# EAGLE schematic plant-monitoring-system (EAGLE 9.3.2)
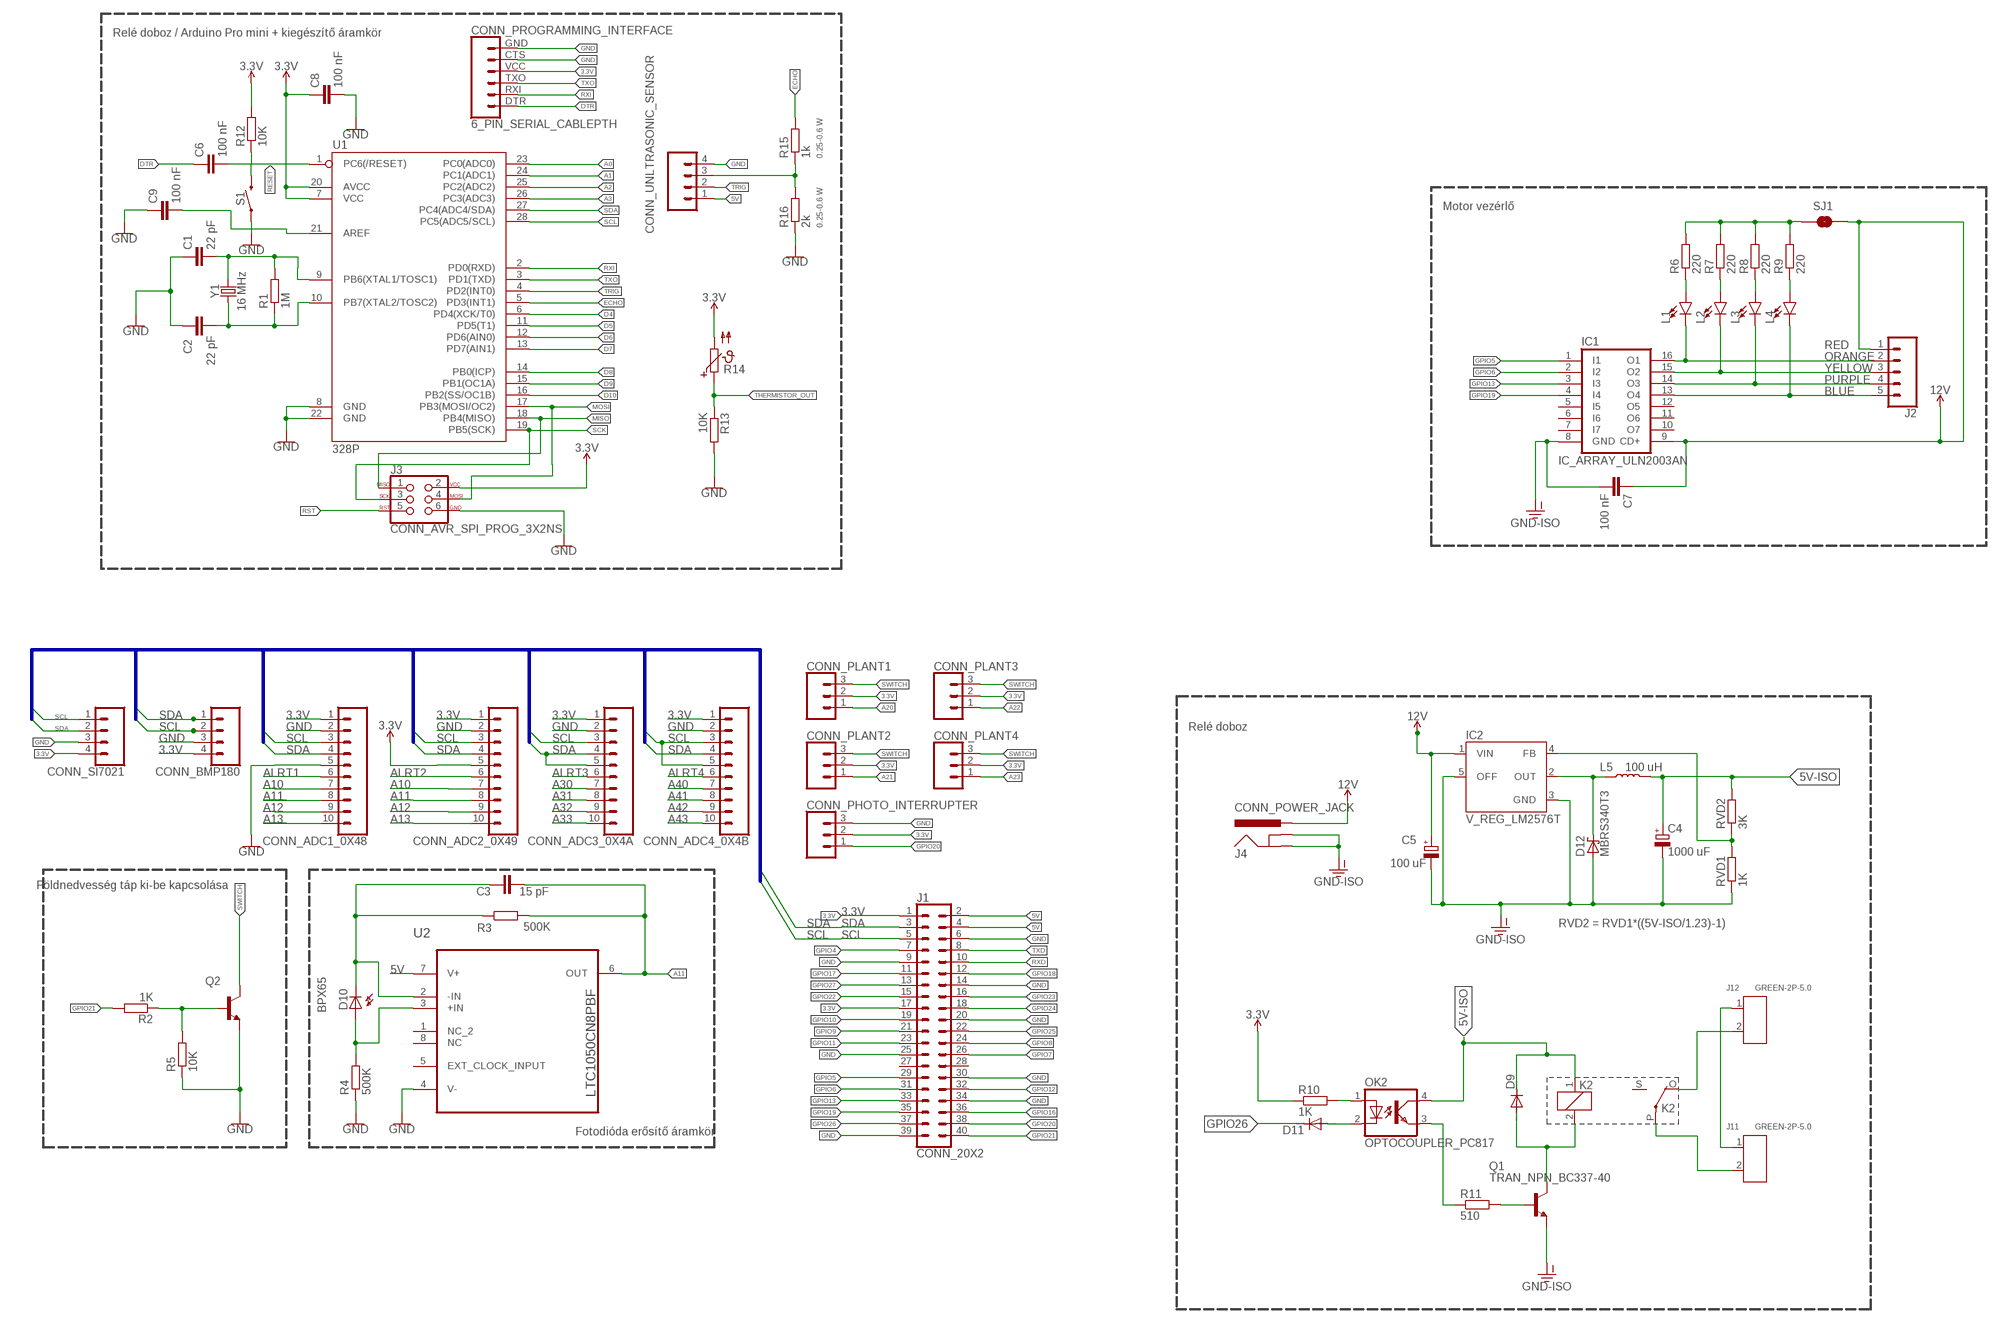
[diagram p0: schematic, sheet 1]

## Parts
C1  22 pF  CAPACITOR_1025-024X044  [C025-024X044]
C2  22 pF  CAPACITOR_1025-024X044  [C025-024X044]
C3  15 pF  CAPACITOR_1025-024X044  [C025-024X044]
C4  1000 uF  CAPACITOR_POLARIZEDE5-10.5  [E5-10,5]
C5  100 uF  CAPACITOR_POLARIZEDE2.5-6  [E2,5-6]
C6  100 nF  CAPACITOR_1025-024X044  [C025-024X044]
C7  100 nF  CAPACITOR_1025-024X044  [C025-024X044]
C8  100 nF  CAPACITOR_1025-024X044  [C025-024X044]
C9  100 nF  CAPACITOR_1025-024X044  [C025-024X044]
CONN_ADC1_0X48  CONN_10"  [1X10]
CONN_ADC2_0X49  CONN_10"  [1X10]
CONN_ADC3_0X4A  CONN_10"  [1X10]
CONN_ADC4_0X4B  CONN_10"  [1X10]
CONN_BMP180  CONN_04  [1X04]
CONN_PHOTO_INTERRUPTER  CONN_03  [1X03]
CONN_PLANT1  CONN_03  [1X03]
CONN_PLANT2  CONN_03  [1X03]
CONN_PLANT3  CONN_03  [1X03]
CONN_PLANT4  CONN_03  [1X03]
CONN_PROGRAMMING_INTERFACE  6_PIN_SERIAL_CABLEPTH  [FTDI_BASIC]
CONN_SI7021  CONN_04  [1X04]
CONN_UNLTRASONIC_SENSOR  CONN_04  [1X04]
D9  DIODED-10  [D-10]
D10  BPX65  [BPX65]
D11  DIODED-7.5  [D-7.5]
D12  MBRS340T3  [SMC]
IC1  IC_ARRAY_ULN2003AN  [DIL16]
IC2  V_REG_LM2576T  [TO220-5]
J1  CONN_20X2  [2X20]
J2  CONN_05  [1X05]
J3  CONN_AVR_SPI_PROG_3X2NS  [2X3-NS]
J4  CONN_POWER_JACK  [POWER_JACK_PTH]
J11  GREEN-2P-5.0  SCREW-TERMINAL-GREEN(2P-5.0)  [H2-5.0-10.5X8.0MM]
J12  GREEN-2P-5.0  SCREW-TERMINAL-GREEN(2P-5.0)  [H2-5.0-10.5X8.0MM]
K2  RELAY_ZF112  [ZF112]
L1  LED3MM  [LED_3MM]
L2  LED3MM  [LED_3MM]
L3  LED3MM  [LED_3MM]
L4  LED3MM  [LED_3MM]
L5  100 uH  INDUCTOR_2-SRN6045-33UH  [SRN6045]
OK2  OPTOCOUPLER_PC817  [DIL04]
Q1  TRAN_NPN_BC337-40  [TO92]
Q2  TRAN_NPN_BC337-40  [TO92]
R1  1M  RESISTOR0207/7  [0207/7]
R2  1K  RESISTOR0207/7  [0207/7]
R3  500K  RESISTOR0207/7  [0207/7]
R4  500K  RESISTOR0207/7  [0207/7]
R5  10K  RESISTOR0207/7  [0207/7]
R6  220  RESISTOR0207/7  [0207/7]
R7  220  RESISTOR0207/7  [0207/7]
R8  220  RESISTOR0207/7  [0207/7]
R9  220  RESISTOR0207/7  [0207/7]
R10  1K  RESISTOR0207/7  [0207/7]
R11  510  RESISTOR0207/7  [0207/7]
R12  10K  RESISTOR0207/7  [0207/7]
R13  10K  RESISTOR0207/7  [0207/7]
R14  PTC679  [P679]
R15  1k  RESISTOR0207/7  [0207/7]
R16  2k  RESISTOR0207/7  [0207/7]
RVD1  1K  RESISTOR0207/7  [0207/7]
RVD2  3K  RESISTOR0207/7  [0207/7]
S1  INPUT_MOMENTARY_SWITCH_SPST-PTH-6.0MM  [TACTILE_SWITCH_PTH_6.0MM]
SJ1  INPUT_SOLDERJUMPERROUND  [SJ_ROUND]
U1  328P  MCU_ATMEGA328P_PDIP  [DIP28]
U2  LTC1050CN8PBF  [DIP254P762X508-8]
Y1  16 MHz  CRYSTALPTH-HC49US  [HC49US]

## Nets
3.3V: C8.1 CONN_ADC1_0X48.1 CONN_ADC2_0X49.1 CONN_ADC2_0X49.5 CONN_ADC3_0X4A.1 CONN_ADC4_0X4B.1 CONN_BMP180.4 CONN_PHOTO_INTERRUPTER.2 CONN_PLANT1.2 CONN_PLANT2.2 CONN_PLANT3.2 CONN_PLANT4.2 CONN_PROGRAMMING_INTERFACE.VCC CONN_SI7021.4 J1.1 J1.17 J3.2 R10.1 R12.2 R14.2 U1.7(VCC) U1.20(AVCC)
5V: CONN_UNLTRASONIC_SENSOR.1 J1.2 J1.4 U2.7(V+)
5V-ISO: C4.+ D9.C K2.1 L5.2 OK2.4(COL) RVD2.2
12V: C5.+ IC2.1(VIN) J4.PWR
A0: U1.23(PC0(ADC0))
A1: U1.24(PC1(ADC1))
A2: U1.25(PC2(ADC2))
A3: U1.26(PC3(ADC3))
A10: CONN_ADC1_0X48.7 CONN_ADC2_0X49.7
A11: C3.2 CONN_ADC1_0X48.8 CONN_ADC2_0X49.8 R3.2 U2.6(OUT)
A12: CONN_ADC1_0X48.9 CONN_ADC2_0X49.9
A13: CONN_ADC1_0X48.10 CONN_ADC2_0X49.10
A20: CONN_PLANT1.1
A21: CONN_PLANT2.1
A22: CONN_PLANT3.1
A23: CONN_PLANT4.1
A30: CONN_ADC3_0X4A.7
A31: CONN_ADC3_0X4A.8
A32: CONN_ADC3_0X4A.9
A33: CONN_ADC3_0X4A.10
A40: CONN_ADC4_0X4B.7
A41: CONN_ADC4_0X4B.8
A42: CONN_ADC4_0X4B.9
A43: CONN_ADC4_0X4B.10
ALRT1: CONN_ADC1_0X48.6
ALRT2: CONN_ADC2_0X49.6
ALRT3: CONN_ADC3_0X4A.6
ALRT4: CONN_ADC4_0X4B.6
BLUE: IC1.13(O4) J2.5 L4.K(C)
D4: U1.6(PD4(XCK/T0))
D5: U1.11(PD5(T1))
D6: U1.12(PD6(AIN0))
D7: U1.13(PD7(AIN1))
D8: U1.14(PB0(ICP))
D9: U1.15(PB1(OC1A))
D10: U1.16(PB2(SS/OC1B))
DTR: C6.1 CONN_PROGRAMMING_INTERFACE.DTR
ECHO: R15.2 U1.5(PD3(INT1))
GND: C1.1 C2.1 C8.2 C9.1 CONN_ADC1_0X48.2 CONN_ADC1_0X48.5 CONN_ADC2_0X49.2 CONN_ADC3_0X4A.2 CONN_ADC4_0X4B.2 CONN_BMP180.3 CONN_PHOTO_INTERRUPTER.3 CONN_PROGRAMMING_INTERFACE.CTS CONN_PROGRAMMING_INTERFACE.GND CONN_SI7021.3 CONN_UNLTRASONIC_SENSOR.4 J1.6 J1.9 J1.14 J1.20 J1.25 J1.30 J1.34 J1.39 J3.6 Q2.1(E) R4.1 R5.1 R13.2 R16.1 S1.1 U1.8(GND) U1.22(GND) U2.4(V-)
GND-ISO: C4.- C5.- C7.2 D12.A IC1.8(GND) IC2.3(GND) IC2.5(OFF) J4.GND J4.GNDBREAK Q1.1(E) RVD1.1
GPIO4: J1.7
GPIO5: IC1.1(I1) J1.29
GPIO6: IC1.2(I2) J1.31
GPIO7: J1.26
GPIO8: J1.24
GPIO9: J1.21
GPIO10: J1.19
GPIO11: J1.23
GPIO12: J1.32
GPIO13: IC1.3(I3) J1.33
GPIO16: J1.36
GPIO17: J1.11
GPIO18: J1.12
GPIO19: IC1.4(I4) J1.35
GPIO20: CONN_PHOTO_INTERRUPTER.1 J1.38
GPIO21: J1.40 R2.2
GPIO22: J1.15
GPIO23: J1.16
GPIO24: J1.18
GPIO25: J1.22
GPIO26: D11.C J1.37
GPIO27: J1.13
MISO: J3.1 U1.18(PB4(MISO))
MOSI: J3.4 U1.17(PB3(MOSI/OC2))
N$5: CONN_UNLTRASONIC_SENSOR.3 R15.1 R16.2
N$6: C3.1 D10.K(C) R3.1 U2.2(-IN)
N$7: D10.A R4.2 U2.3(+IN)
N$12: Q2.2(B) R2.1 R5.2
N$23: L1.A R6.1
N$24: L2.A R7.1
N$25: L3.A R8.1
N$26: L4.A R9.1
N$27: R6.2 R7.2 R8.2 R9.2 SJ1.1
N$28: OK2.3(EMIT) R11.1
N$29: D9.A K2.2 Q1.3(C)
N$30: OK2.1(A) R10.2
N$31: D11.A OK2.2(C)
N$33: J12.2 K2.O(2:O)
N$34: Q1.2(B) R11.2
N$35: J11.1 J12.1
N$36: J11.2 K2.P(2:P)
N$37: C1.2 R1.2 U1.9(PB6(XTAL1/TOSC1)) Y1.2
N$38: D12.C IC2.2(OUT) L5.1
N$39: IC2.4(FB) RVD1.2 RVD2.1
N$40: C2.2 R1.1 U1.10(PB7(XTAL2/TOSC2)) Y1.1
N$45: C9.2 U1.21(AREF)
ORANGE: IC1.16(O1) J2.2 L1.K(C)
PURPLE: IC1.14(O3) J2.4 L3.K(C)
RED: C7.1 IC1.9(CD+) J2.1 SJ1.2 ; supply symbol labelled 12V
RESET: C6.2 R12.1 S1.3 U1.1(PC6(/RESET))
RST: J3.5
RXD: J1.10
RXI: CONN_PROGRAMMING_INTERFACE.RXI U1.2(PD0(RXD))
SCK: J3.3 U1.19(PB5(SCK))
SCL: CONN_ADC1_0X48.3 CONN_ADC2_0X49.3 CONN_ADC3_0X4A.3 CONN_ADC4_0X4B.3 CONN_ADC4_0X4B.5 CONN_BMP180.1 CONN_SI7021.1 J1.5 U1.28(PC5(ADC5/SCL))
SDA: CONN_ADC1_0X48.4 CONN_ADC2_0X49.4 CONN_ADC3_0X4A.4 CONN_ADC3_0X4A.5 CONN_ADC4_0X4B.4 CONN_BMP180.2 CONN_SI7021.2 J1.3 U1.27(PC4(ADC4/SDA))
SWITCH: CONN_PLANT1.3 CONN_PLANT2.3 CONN_PLANT3.3 CONN_PLANT4.3 Q2.3(C)
THERMISTOR_OUT: R13.1 R14.1
TRIG: CONN_UNLTRASONIC_SENSOR.2 U1.4(PD2(INT0))
TXD: J1.8
TXO: CONN_PROGRAMMING_INTERFACE.TXO U1.3(PD1(TXD))
YELLOW: IC1.15(O2) J2.3 L2.K(C)
Unconnected: IC1.5(I5) IC1.6(I6) IC1.7(I7) IC1.10(O7) IC1.11(O6) IC1.12(O5) J1.27 J1.28 K2.S(2:S) U2.1(NC_2) U2.5(EXT_CLOCK_INPUT) U2.8(NC)

## Buses
I2C:SCL,SDA
SCL,SDA

## Notes on the sheet
- Relé doboz / Arduino Pro mini + kiegészítő áramkör
- Motor vezérlő
- Relé doboz
- Földnedvesség táp ki-be kapcsolása
- RVD2 = RVD1*((5V-ISO/1.23)-1)
- Fotodióda erősítő áramkör

## Library data of the parts
C1-C3 C6-C9 = 001-private-inventory:CAPACITOR_1: CAPACITOR, European symbol; SPICEPREFIX: C
C4 C5 = 001-private-inventory:CAPACITOR_POLARIZED: POLARIZED CAPACITOR, European symbol; SPICEPREFIX: C
CONN_ADC1_0X48 CONN_ADC2_0X49 CONN_ADC3_0X4A CONN_ADC4_0X4B = 001-private-inventory:CONN_10: Multi connection point. Often used as Generic Header-pin footprint for 0.1 inch spaced/style header connections On any of the 0.1 inch spaced packages, you can populate with these: Break Away Headers - Straight <https://www.sparkfun.com/products/116> (PRT-00116) Break Away Male Headers - Right Angle <https://www.sparkfun.com/products/553> (PRT-00553) Female Headers <https://www.sparkfun.com/products/115> (PRT-00115) Break Away Headers - Machine Pin <https://www.sparkfun.com/products/117> (PRT-00117) Break Away Female Headers - Swiss Machine Pin <https://www.sparkfun.com/products/743> (PRT-00743) Arduino Stackable Header - 10 Pin <https://www.sparkfun.com/products/11376> (PRT-11376) For SCREWTERMINALS and SPRING TERMINALS visit here: Screw Terimnals on SparkFun.com <https://www.sparkfun.com/search/results?term=Screw+Terminals> (5mm/3.5mm/2.54mm spacing) This device is also useful as a general connection point to wire up your design to another part of your project. Our various solder wires solder well into these plated through hole pads. Hook-Up Wire - Assortment (Stranded, 22 AWG) <https://www.sparkfun.com/products/11375> (PRT-11375) Hook-Up Wire - Assortment (Solid Core, 22 AWG) <https://www.sparkfun.com/products/11367> (PRT-11367) View the entire wire category on our website here <https://www.sparkfun.com/categories/141> Special notes: Molex polarized connector foot print use with SKU : PRT-08231 with associated crimp pins and housings. 1MM SMD Version SKU: PRT-10208 NOTES ON THE VARIANTS LOCK and LOCK_LONGPADS... This footprint was designed to help hold the alignment of a through-hole component (i.e. 6-pin header) while soldering it into place. You may notice that each hole has been shifted either up or down by 0.005 of an inch from it's more standard position (which is a perfectly straight line). This slight alteration caused the pins (the squares in the middle) to touch the edges of the holes. Because they are alternating, it causes a "brace" to hold the component in place. 0.005 has proven to be the perfect amount of "off-center" position when using our standard breakaway headers. Although looks a little odd when you look at the bare footprint, once you have a header in there, the alteration is very hard to notice. Also,if you push a header all the way into place, it is covered up entirely on the bottom side.; PROD_ID: CONN-11563
CONN_BMP180 CONN_SI7021 = SparkFun-Connectors:CONN_04: Multi connection point. Often used as Generic Header-pin footprint for 0.1 inch spaced/style header connections On any of the 0.1 inch spaced packages, you can populate with these: Break Away Headers - Straight <https://www.sparkfun.com/products/116> (PRT-00116) Break Away Male Headers - Right Angle <https://www.sparkfun.com/products/553> (PRT-00553) Female Headers <https://www.sparkfun.com/products/115> (PRT-00115) Break Away Headers - Machine Pin <https://www.sparkfun.com/products/117> (PRT-00117) Break Away Female Headers - Swiss Machine Pin <https://www.sparkfun.com/products/743> (PRT-00743) For SCREWTERMINALS and SPRING TERMINALS visit here: Screw Terimnals on SparkFun.com <https://www.sparkfun.com/search/results?term=Screw+Terminals> (5mm/3.5mm/2.54mm spacing) This device is also useful as a general connection point to wire up your design to another part of your project. Our various solder wires solder well into these plated through hole pads. Hook-Up Wire - Assortment (Stranded, 22 AWG) <https://www.sparkfun.com/products/11375> (PRT-11375) Hook-Up Wire - Assortment (Solid Core, 22 AWG) <https://www.sparkfun.com/products/11367> (PRT-11367) View the entire wire category on our website here <https://www.sparkfun.com/categories/141> Special notes: Molex polarized connector foot print use with SKU : PRT-08231 with associated crimp pins and housings. 1MM SMD Version SKU: PRT-10208; PROD_ID: CONN-09696
CONN_PHOTO_INTERRUPTER = 001-private-inventory:CONN_03: Multi connection point. Often used as Generic Header-pin footprint for 0.1 inch spaced/style header connections On any of the 0.1 inch spaced packages, you can populate with these: Break Away Headers - Straight <https://www.sparkfun.com/products/116> (PRT-00116) Break Away Male Headers - Right Angle <https://www.sparkfun.com/products/553> (PRT-00553) Female Headers <https://www.sparkfun.com/products/115> (PRT-00115) Break Away Headers - Machine Pin <https://www.sparkfun.com/products/117> (PRT-00117) Break Away Female Headers - Swiss Machine Pin <https://www.sparkfun.com/products/743> (PRT-00743) Stackable Header - 3 Pin (Female, 0.1") <https://www.sparkfun.com/products/13875> (PRT-13875) For SCREWTERMINALS and SPRING TERMINALS visit here: Screw Terimnals on SparkFun.com <https://www.sparkfun.com/search/results?term=Screw+Terminals> (5mm/3.5mm/2.54mm spacing) This device is also useful as a general connection point to wire up your design to another part of your project. Our various solder wires solder well into these plated through hole pads. Hook-Up Wire - Assortment (Stranded, 22 AWG) <https://www.sparkfun.com/products/11375> (PRT-11375) Hook-Up Wire - Assortment (Solid Core, 22 AWG) <https://www.sparkfun.com/products/11367> (PRT-11367) View the entire wire category on our website here <https://www.sparkfun.com/categories/141> Special notes: Molex polarized connector foot print use with SKU : PRT-08232 with associated crimp pins and housings.
CONN_PLANT1-CONN_PLANT4 = SparkFun-Connectors:CONN_03: Multi connection point. Often used as Generic Header-pin footprint for 0.1 inch spaced/style header connections On any of the 0.1 inch spaced packages, you can populate with these: Break Away Headers - Straight <https://www.sparkfun.com/products/116> (PRT-00116) Break Away Male Headers - Right Angle <https://www.sparkfun.com/products/553> (PRT-00553) Female Headers <https://www.sparkfun.com/products/115> (PRT-00115) Break Away Headers - Machine Pin <https://www.sparkfun.com/products/117> (PRT-00117) Break Away Female Headers - Swiss Machine Pin <https://www.sparkfun.com/products/743> (PRT-00743) Stackable Header - 3 Pin (Female, 0.1") <https://www.sparkfun.com/products/13875> (PRT-13875) For SCREWTERMINALS and SPRING TERMINALS visit here: Screw Terimnals on SparkFun.com <https://www.sparkfun.com/search/results?term=Screw+Terminals> (5mm/3.5mm/2.54mm spacing) This device is also useful as a general connection point to wire up your design to another part of your project. Our various solder wires solder well into these plated through hole pads. Hook-Up Wire - Assortment (Stranded, 22 AWG) <https://www.sparkfun.com/products/11375> (PRT-11375) Hook-Up Wire - Assortment (Solid Core, 22 AWG) <https://www.sparkfun.com/products/11367> (PRT-11367) View the entire wire category on our website here <https://www.sparkfun.com/categories/141> Special notes: Molex polarized connector foot print use with SKU : PRT-08232 with associated crimp pins and housings.
CONN_PROGRAMMING_INTERFACE = SparkFun-Connectors:6_PIN_SERIAL_CABLE: 6-pin header connection for use with the "FTDI BASIC" pinout - CABLE SIDE. Also known as "Arduino Serial Program Header". This is used on a design to provide a 6-pin connection point for serial communication usually from a USB cable (D+/D-) to these headers (RX/TX). It also has the remaining pins necessary for programming in the Arduino evironment (DTR, GND, and sometimes VCC). Note, this device has "CABLE" in the name. It is intended to be used on a design that usually lives on the end of your USB cable and prvides the converter chip (FTDI232 or FTDI231x) to commnicate serial RX/TX. The "sister" device, named "TARGET" is inteneded to be used on a design that contains a target micro-controller that you wish to program. You can populate with some of these: Female Headers <https://www.sparkfun.com/products/115> (PRT-00115) For reference (or to suit your programming needs) check out these designs: SparkFun FTDI Basic Breakout - 5V <https://www.sparkfun.com/products/9716> (DEV-09716) SparkFun FTDI Basic Breakout - 3.3V <https://www.sparkfun.com/products/9873> (DEV-09873) SparkFun FTDI SmartBasic <https://www.sparkfun.com/products/12935> (DEV-12935) SparkFun Beefy 3 - FTDI Basic Breakout <https://www.sparkfun.com/products/13746> (DEV-13746)
CONN_UNLTRASONIC_SENSOR = 001-private-inventory:CONN_04: Multi connection point. Often used as Generic Header-pin footprint for 0.1 inch spaced/style header connections On any of the 0.1 inch spaced packages, you can populate with these: Break Away Headers - Straight <https://www.sparkfun.com/products/116> (PRT-00116) Break Away Male Headers - Right Angle <https://www.sparkfun.com/products/553> (PRT-00553) Female Headers <https://www.sparkfun.com/products/115> (PRT-00115) Break Away Headers - Machine Pin <https://www.sparkfun.com/products/117> (PRT-00117) Break Away Female Headers - Swiss Machine Pin <https://www.sparkfun.com/products/743> (PRT-00743) For SCREWTERMINALS and SPRING TERMINALS visit here: Screw Terimnals on SparkFun.com <https://www.sparkfun.com/search/results?term=Screw+Terminals> (5mm/3.5mm/2.54mm spacing) This device is also useful as a general connection point to wire up your design to another part of your project. Our various solder wires solder well into these plated through hole pads. Hook-Up Wire - Assortment (Stranded, 22 AWG) <https://www.sparkfun.com/products/11375> (PRT-11375) Hook-Up Wire - Assortment (Solid Core, 22 AWG) <https://www.sparkfun.com/products/11367> (PRT-11367) View the entire wire category on our website here <https://www.sparkfun.com/categories/141> Special notes: Molex polarized connector foot print use with SKU : PRT-08231 with associated crimp pins and housings. 1MM SMD Version SKU: PRT-10208; PROD_ID: CONN-09696
D9 D11 = 001-private-inventory:DIODE: DIODE
D10 = opto-trans-siemens:BPX65: PHOTO DIODE; MPN: BPX65.; OC_FARNELL: 327451; OC_NEWARK: 06WX2764
D12 = diode:MBRS3*0T3: SCHOTTKY BARRIER RECTIFIER 3.0 AMPERES 20, 30, 40 VOLT Source: MBRS340T3-D.pdf
IC1 = 001-private-inventory:IC_ARRAY_ULN2003A: DRIVER ARRAY
IC2 = 001-private-inventory:V_REG_LM2576: National Semiconductor <http://www.national.com> 3.0A "Simple Switcher"(c) 52kHz, Vout 1.23-37V (HV: 57V), Vin 40V (HV: 60V), 50µA standby current
J1 = SparkFun-Connectors:CONN_20X2: Multi connection point. Often used as Generic Header-pin footprint for 0.1 inch spaced/style header connections On any of the 0.1 inch spaced packages, you can populate with these: Break Away Headers - Straight <https://www.sparkfun.com/products/116> (PRT-00116) Break Away Male Headers - Right Angle <https://www.sparkfun.com/products/553> (PRT-00553) Female Headers <https://www.sparkfun.com/products/115> (PRT-00115) Break Away Headers - Machine Pin <https://www.sparkfun.com/products/117> (PRT-00117) Break Away Female Headers - Swiss Machine Pin <https://www.sparkfun.com/products/743> (PRT-00743)
J2 = 001-private-inventory:CONN_05: Multi connection point. Often used as Generic Header-pin footprint for 0.1 inch spaced/style header connections On any of the 0.1 inch spaced packages, you can populate with these: Break Away Headers - Straight <https://www.sparkfun.com/products/116> (PRT-00116) Break Away Male Headers - Right Angle <https://www.sparkfun.com/products/553> (PRT-00553) Female Headers <https://www.sparkfun.com/products/115> (PRT-00115) Break Away Headers - Machine Pin <https://www.sparkfun.com/products/117> (PRT-00117) Break Away Female Headers - Swiss Machine Pin <https://www.sparkfun.com/products/743> (PRT-00743) For SCREWTERMINALS and SPRING TERMINALS visit here: Screw Terimnals on SparkFun.com <https://www.sparkfun.com/search/results?term=Screw+Terminals> (5mm/3.5mm/2.54mm spacing) This device is also useful as a general connection point to wire up your design to another part of your project. Our various solder wires solder well into these plated through hole pads. Hook-Up Wire - Assortment (Stranded, 22 AWG) <https://www.sparkfun.com/products/11375> (PRT-11375) Hook-Up Wire - Assortment (Solid Core, 22 AWG) <https://www.sparkfun.com/products/11367> (PRT-11367) View the entire wire category on our website here <https://www.sparkfun.com/categories/141> Special notes: Molex polarized connector foot print use with SKU : PRT-08231 with associated crimp pins and housings. 1MM SMD Version SKU: PRT-10208
J3 = 001-private-inventory:CONN_AVR_SPI_PROG_3X2: AVR ISP 6 Pin This is the reduced ISP connector for AVR programming. Common on Arduino. This footprint will take up less PCB space and can be used with a 10-pin to 6-pin adapter such as SKU: BOB-08508 **Special note about "TEST_POINT" package. The stop mask is on the top side, so if you want your programming test points to be on the bottom of your board, make sure to place this package on the bottom side of the board. This also ensure that the orientation to program from the bottom side will be correct. SparkFun Products: SparkFun ISP Pogo Adapter <https://www.sparkfun.com/products/11591> - NS Tiny AVR Programmer <https://www.sparkfun.com/products/11801> -PTH
J4 = 001-private-inventory:CONN_POWER_JACK: Power Jack Connector This is the standard 5.5mm barrel jack for power. The PTH is the most common, proven, reliable, footprint. The Slot footprint only works if the mill layer is transmitted to the PCB fab house so be warned. Here are the connectors we sell at SparkFun: DC Barrel Power Jack/Connector <https://www.sparkfun.com/products/119> (PRT-00119) DC Barrel Power Jack/Connector (SMD) <https://www.sparkfun.com/products/12748> (PRT-12748) DC Barrel Jack Adapter - Breadboard Compatible <https://www.sparkfun.com/products/10811> (PRT-10811) It is used on this SparkFun product (and many, many others): SparkFun RedBoard - Programmed with Arduino <https://www.sparkfun.com/products/12757> (DEV-12757) Also, if you need a mating power supply or connector, please check these out: Wall Adapter Power Supply - 9VDC 650mA <https://www.sparkfun.com/products/298> (TOL-00298) DC Barrel Jack Adapter - Male <https://www.sparkfun.com/products/10287> (PRT-10287); PROD_ID: CONN-08197
J11 J12 = Seeed-Connector:SCREW-TERMINAL-GREEN(2P-5.0): 320110031
K2 = 001-private-inventory:RELAY_ZF112: RELAY 1 x switch; OC_FARNELL: unknown; OC_NEWARK: unknown
L1-L4 = 001-private-inventory:LED: LED (Generic) Standard schematic elements and footprints for 5mm, 3mm, 1206, and 0603 sized LEDs. Generic LEDs with no color specified.; PROD_ID: DIO-08794
L5 = 001-private-inventory:INDUCTOR_2: Inductors Resist changes in electrical current. Basically a coil of wire. SparkFun Products: SparkFun Load Cell Amplifier - HX711 <https://www.sparkfun.com/products/13879> IOIO-OTG - V2.2 <https://www.sparkfun.com/products/13613>; PROD_ID: NDUC-11627; VALUE: 33µH/±20%/1.4A
OK2 = 001-private-inventory:OPTOCOUPLER_PC817: SHARP OPTO COUPLER; MPN: PC817X4J000F; OC_FARNELL: 9707727; OC_NEWARK: 97K7059
Q1 Q2 = 001-private-inventory:TRAN_NPN_BC337*: NPN Transistor
R1-R13 RVD1 RVD2 = 001-private-inventory:RESISTOR: RESISTOR, European symbol; POWER: 0.25-0.6 W; SPICEPREFIX: R
R14 = ptc-ntc:PTC679: PHILIPS PTC; OC_FARNELL: unknown; OC_NEWARK: unknown
R15 R16 = 006-rcl:RESISTOR: RESISTOR, European symbol; POWER: 0.25-0.6 W; SPICEPREFIX: R
S1 = 001-private-inventory:INPUT_MOMENTARY_SWITCH_SPST: Momentary Switch (Pushbutton) - SPST Normally-open (NO) SPST momentary switches (buttons, pushbuttons). Variants PTH-12MM - 12mm square, through-hole Momentary Pushbutton Switch - 12mm Square <https://www.sparkfun.com/products/9190> (COM-09190) PTH-6.0MM, PTH-6.0MM-KIT - 6.0mm square, through-hole Mini Pushbutton Switch <https://www.sparkfun.com/products/97> (COM-00097) KIT package intended for soldering kit's - only one side of pads' copper is exposed. PTH-RIGHT-ANGLE-KIT - Right-angle, through-hole Right Angle Tactile Button <https://www.sparkfun.com/products/10791> - Used on SparkFun BigTime Watch Kit <https://www.sparkfun.com/products/11734> SMD-12MM - 12mm square, surface-mount Tactile Button - SMD (12mm) <https://www.sparkfun.com/products/12993> (COM-12993) Used on SparkFun PicoBoard <https://www.sparkfun.com/products/11888> SMD-4.5MM - 4.5mm Square Trackball Switch Used on SparkFun Blackberry Trackballer Breakout <https://www.sparkfun.com/products/13169> SMD-4.6MMX2.8MM - 4.60mm x 2.80mm, surface mount Used on SparkFun SAMD21 Mini Breakout <https://www.sparkfun.com/products/13664> SMD-5.2MM, SMD-5.2-REDUNDANT - 5.2mm square, surface-mount Mini Pushbutton Switch - SMD <https://www.sparkfun.com/products/8720> (COM-08720) Used on Arduino Pro Mini <https://www.sparkfun.com/products/11114> REDUNDANT package connects both switch circuits together SMD-6.0X3.5MM - 6.0 x 3.5mm, surface mount Momentary Reset Switch SMD <https://www.sparkfun.com/products/8229> (COM-08229) SMD-6.2MM-TALL - 6.2mm square, surface mount Tactile Button - SMD (6mm) <https://www.sparkfun.com/products/12992> Used on SparkFun Digital Sandbox <https://www.sparkfun.com/products/12651> SMD-RIGHT-ANGLE - Right-angle, surface mount Used on SparkFun Block for Intel® Edison - Arduino <https://www.sparkfun.com/products/13036>; PROD_ID: SWCH-08441; SF_SKU: COM-00097
SJ1 = 001-private-inventory:INPUT_SOLDERJUMPER: Solder Jumper Standard SMD solder jumper. Used to automate production. Two varients : Normally Open and Normally Closed are the same, but have different paste layers. NC will have a large amount of paste and should jumper during reflow.
U1 = 001-private-inventory:MCU_ATMEGA328P_PDIP: Atmel 328P Through hole ATMEGA328P uC used in the Arduino 32kb flash, 1k EEPROM, 2k SRAM Datasheet <http://www.sparkfun.com/datasheets/Components/SMD/ATMega328.pdf> SparkFun Products Storefront component: AVR 28 Pin 20MHz 32K 6A/D - ATMega328P <https://www.sparkfun.com/products/9061> (COM-09061) SparkFun Simon Says - Through-Hole Soldering Kit <https://www.sparkfun.com/products/10547> (KIT-10547) SparkFun Learn to Solder - Simon Says <https://www.sparkfun.com/products/13708> (KIT-13708) SparkFun BigTime Watch Kit <https://www.sparkfun.com/products/11734> (KIT-11734) SparkFun ClockIt <https://www.sparkfun.com/products/10930> (KIT-10930) SparkFun Serial Enabled LCD Kit <https://www.sparkfun.com/products/10097> (LCD-10097) SparkFun Simon Tilts - Through Hole Soldering Kit <https://www.sparkfun.com/products/12634> (KIT-12634) SparkFun Frequency Counter Kit <https://www.sparkfun.com/products/10140> (KIT-10140) FabFM Radio Kit <https://www.sparkfun.com/products/11043> (KIT-11043) SparkFun Binary Blaster Kit <https://www.sparkfun.com/products/12037> (KIT-12037) SparkFun Metro-Gnome <https://www.sparkfun.com/products/9236> (KIT-09236) ATmega328 with Arduino Optiboot (Uno) <https://www.sparkfun.com/products/10524> (DEV-10524); PROD_ID: IC-09136
U2 = LTC_By_element14_Batch_1:LTC1050CN8PBF: Operational Amplifier; MPN: LTC1050CN8#PBF; OC_FARNELL: 9560769; OC_NEWARK: 55M8938; PACKAGE: PDIP; SUPPLIER: LINEAR TECHNOLOGY
Y1 = 001-private-inventory:CRYSTAL: Crystals (Generic) These are passive quartz crystals, which can be used as a clock source for a microcontroller. Crystal's are two-terminal devices. They require external "load" capacitors to generate an oscillating signal.